# EAGLE schematic rc-tx-board-V1 (EAGLE 9.1.3)

## Sheet 1 of 2
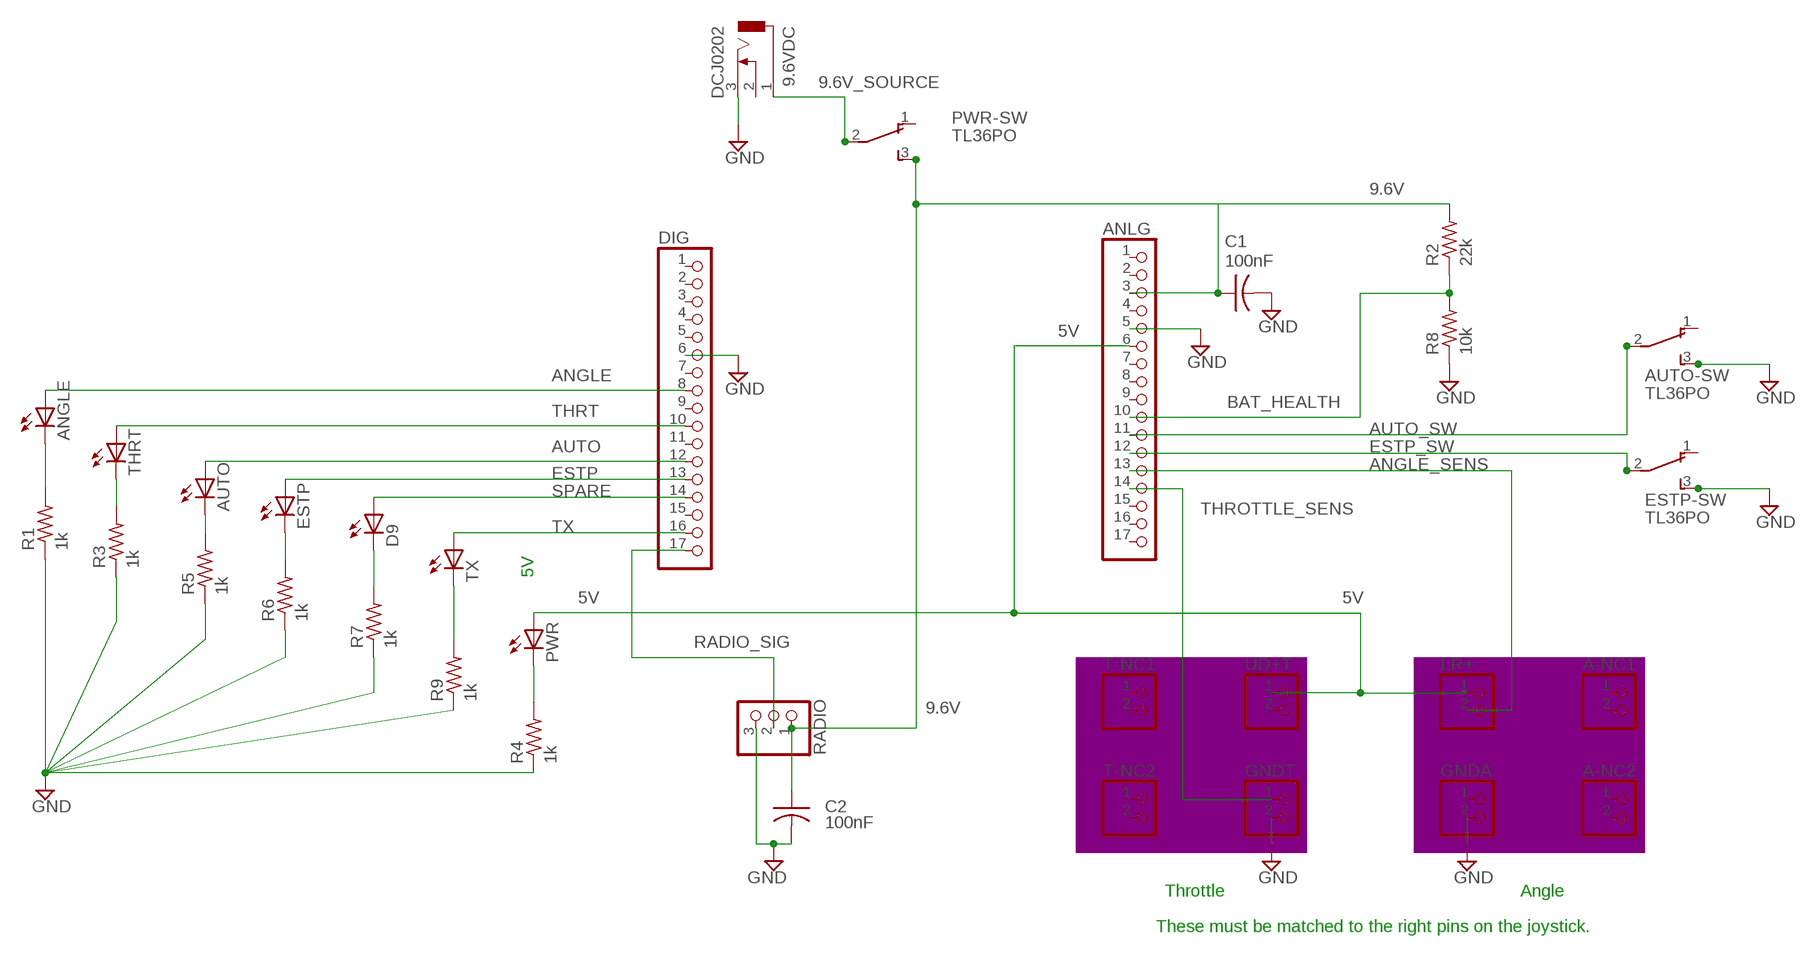
[diagram p0: schematic, sheet 1]

### Parts
9.6VDC  DCJ0202  [DCJ0202]
A-NC1  PINHD-1X2  [1X02]
A-NC2  PINHD-1X2  [1X02]
ANGLE  LED5MM  [LED5MM]
ANLG  PINHD-1X17  [1X17]
AUTO  LED5MM  [LED5MM]
AUTO-SW  TL36PO  [TL3XPO]
C1  100nF  C-US050-024X044  [C050-024X044]
C2  100nF  C-US050-024X044  [C050-024X044]
D9  LED5MM  [LED5MM]
DIG  PINHD-1X17  [1X17]
ESTP  LED5MM  [LED5MM]
ESTP-SW  TL36PO  [TL3XPO]
GNDA  PINHD-1X2  [1X02]
GNDT  PINHD-1X2  [1X02]
LR+  PINHD-1X2  [1X02]
PWR  LED5MM  [LED5MM]
PWR-SW  TL36PO  [TL3XPO]
R1  1k  R-US_0207/10  [0207/10]
R2  22k  R-US_0207/10  [0207/10]
R3  1k  R-US_0207/10  [0207/10]
R4  1k  R-US_0207/10  [0207/10]
R5  1k  R-US_0207/10  [0207/10]
R6  1k  R-US_0207/10  [0207/10]
R7  1k  R-US_0207/10  [0207/10]
R8  10k  R-US_0207/10  [0207/10]
R9  1k  R-US_0207/10  [0207/10]
RADIO  PINHD-1X3  [1X03]
T-NC1  PINHD-1X2  [1X02]
T-NC2  PINHD-1X2  [1X02]
THRT  LED5MM  [LED5MM]
TX  LED5MM  [LED5MM]
UD+T  PINHD-1X2  [1X02]

### Nets
5V: ANLG.6 LR+.1 PWR.A UD+T.1
9.6V: ANLG.3 C1.1 C2.1 PWR-SW.3(S) R2.2 RADIO.1
9.6V_SOURCE: 9.6VDC.1 PWR-SW.2(P)
ANGLE: ANGLE.A DIG.8
ANGLE_R: ANGLE.K(C) R1.2
ANGLE_SENS: ANLG.13 LR+.2
AUTO: AUTO.A DIG.12
AUTO_R: AUTO.K(C) R5.2
AUTO_SW: ANLG.11 AUTO-SW.2(P)
BAT_HEALTH: ANLG.10 R2.1 R8.2
ESTP: DIG.13 ESTP.A
ESTP_R: ESTP.K(C) R6.2
ESTP_SW: ANLG.12 ESTP-SW.2(P)
GND: 9.6VDC.3 ANLG.5 AUTO-SW.3(S) C1.2 C2.2 DIG.6 ESTP-SW.3(S) GNDA.2 GNDT.2 R1.1 R3.1 R4.1 R5.1 R6.1 R7.1 R8.1 R9.1 RADIO.3
PWR_R: PWR.K(C) R4.2
RADIO_SIG: DIG.17 RADIO.2
SPARE: D9.A DIG.14
SPARE_R: D9.K(C) R7.2
THROTTLE_SENS: ANLG.14 GNDT.1
THRT: DIG.10 THRT.A
THRT_R: R3.2 THRT.K(C)
TX: DIG.16 TX.A
TX_R: R9.2 TX.K(C)
Unconnected: 9.6VDC.2 A-NC1.1 A-NC1.2 A-NC2.1 A-NC2.2 ANLG.1 ANLG.2 ANLG.4 ANLG.7 ANLG.8 ANLG.9 ANLG.15 ANLG.16 ANLG.17 AUTO-SW.1(O) DIG.1 DIG.2 DIG.3 DIG.4 DIG.5 DIG.7 DIG.9 DIG.11 DIG.15 ESTP-SW.1(O) GNDA.1 PWR-SW.1(O) T-NC1.1 T-NC1.2 T-NC2.1 T-NC2.2 UD+T.2

### Notes on the sheet
- 5V
- Throttle | Angle
- These must be matched to the right pins on the joystick.

## Sheet 2 of 2

## Library data of the parts
9.6VDC = con-jack:DCJ0202: DC POWER JACK Source: DCJ0202.pdf; OC_FARNELL: unknown; OC_NEWARK: unknown
A-NC1 A-NC2 GNDA GNDT LR+ T-NC1 T-NC2 UD+T = pinhead:PINHD-1X2: PIN HEADER
ANGLE AUTO D9 ESTP PWR THRT TX = led:LED: LED OSRAM: - CHIPLED LG R971, LG N971, LY N971, LG Q971, LY Q971, LO R971, LY R971 LH N974, LH R974 LS Q976, LO Q976, LY Q976 LO Q996 - Hyper CHIPLED LW Q18S LB Q993, LB Q99A, LB R99A - SideLED LS A670, LO A670, LY A670, LG A670, LP A670 LB A673, LV A673, LT A673, LW A673 LH A674 LY A675 LS A676, LA A676, LO A676, LY A676, LW A676 LS A679, LY A679, LG A679 - Hyper Micro SIDELED® LS Y876, LA Y876, LO Y876, LY Y876 LT Y87S - SmartLED LW L88C, LW L88S LB L89C, LB L89S, LG L890 LS L89K, LO L89K, LY L89K LS L896, LA L896, LO L896, LY L896 - TOPLED LS T670, LO T670, LY T670, LG T670, LP T670 LSG T670, LSP T670, LSY T670, LOP T670, LYG T670 LG T671, LOG T671, LSG T671 LB T673, LV T673, LT T673, LW T673 LH T674 LS T676, LA T676, LO T676, LY T676, LB T676, LH T676, LSB T676, LW T676 LB T67C, LV T67C, LT T67C, LS T67K, LO T67K, LY T67K, LW E67C LS E67B, LA E67B, LO E67B, LY E67B, LB E67C, LV E67C, LT E67C LW T67C LS T679, LY T679, LG T679 LS T770, LO T770, LY T770, LG T770, LP T770 LB T773, LV T773, LT T773, LW T773 LH T774 LS E675, LA E675, LY E675, LS T675 LS T776, LA T776, LO T776, LY T776, LB T776 LHGB T686 LT T68C, LB T68C - Hyper Mini TOPLED® LB M676 - Mini TOPLED Santana® LG M470 LS M47K, LO M47K, LY M47K Source: http://www.osram.convergy.de LUXEON: - LUMILED® LXK2-PW12-R00, LXK2-PW12-S00, LXK2-PW14-U00, LXK2-PW14-V00 LXK2-PM12-R00, LXK2-PM12-S00, LXK2-PM14-U00 LXK2-PE12-Q00, LXK2-PE12-R00, LXK2-PE12-S00, LXK2-PE14-T00, LXK2-PE14-U00 LXK2-PB12-K00, LXK2-PB12-L00, LXK2-PB12-M00, LXK2-PB14-N00, LXK2-PB14-P00, LXK2-PB14-Q00 LXK2-PR12-L00, LXK2-PR12-M00, LXK2-PR14-Q00, LXK2-PR14-R00 LXK2-PD12-Q00, LXK2-PD12-R00, LXK2-PD12-S00 LXK2-PH12-R00, LXK2-PH12-S00 LXK2-PL12-P00, LXK2-PL12-Q00, LXK2-PL12-R00 Source: www.luxeon.com KINGBRIGHT: KA-3528ASYC Source: www.kingbright.com
ANLG DIG = pinhead:PINHD-1X17: PIN HEADER
AUTO-SW ESTP-SW PWR-SW = switch:TL36PO: TINY SWITCH ON - ON Source: http://www2.produktinfo.conrad.com/datenblaetter/700000-724999/705152-da-01-de-Subminiaturschalter_TL_36YO.pdf
C1 C2 = resistor:C-US: CAPACITOR, American symbol
R1-R9 = rcl:R-US_: RESISTOR, American symbol
RADIO = pinhead:PINHD-1X3: PIN HEADER